# Altium schematic sheet Sheet2.SchDoc
size A3 portrait; Author: Gayani_Hewasura; Revision: *Keypad_Input_Subsystem
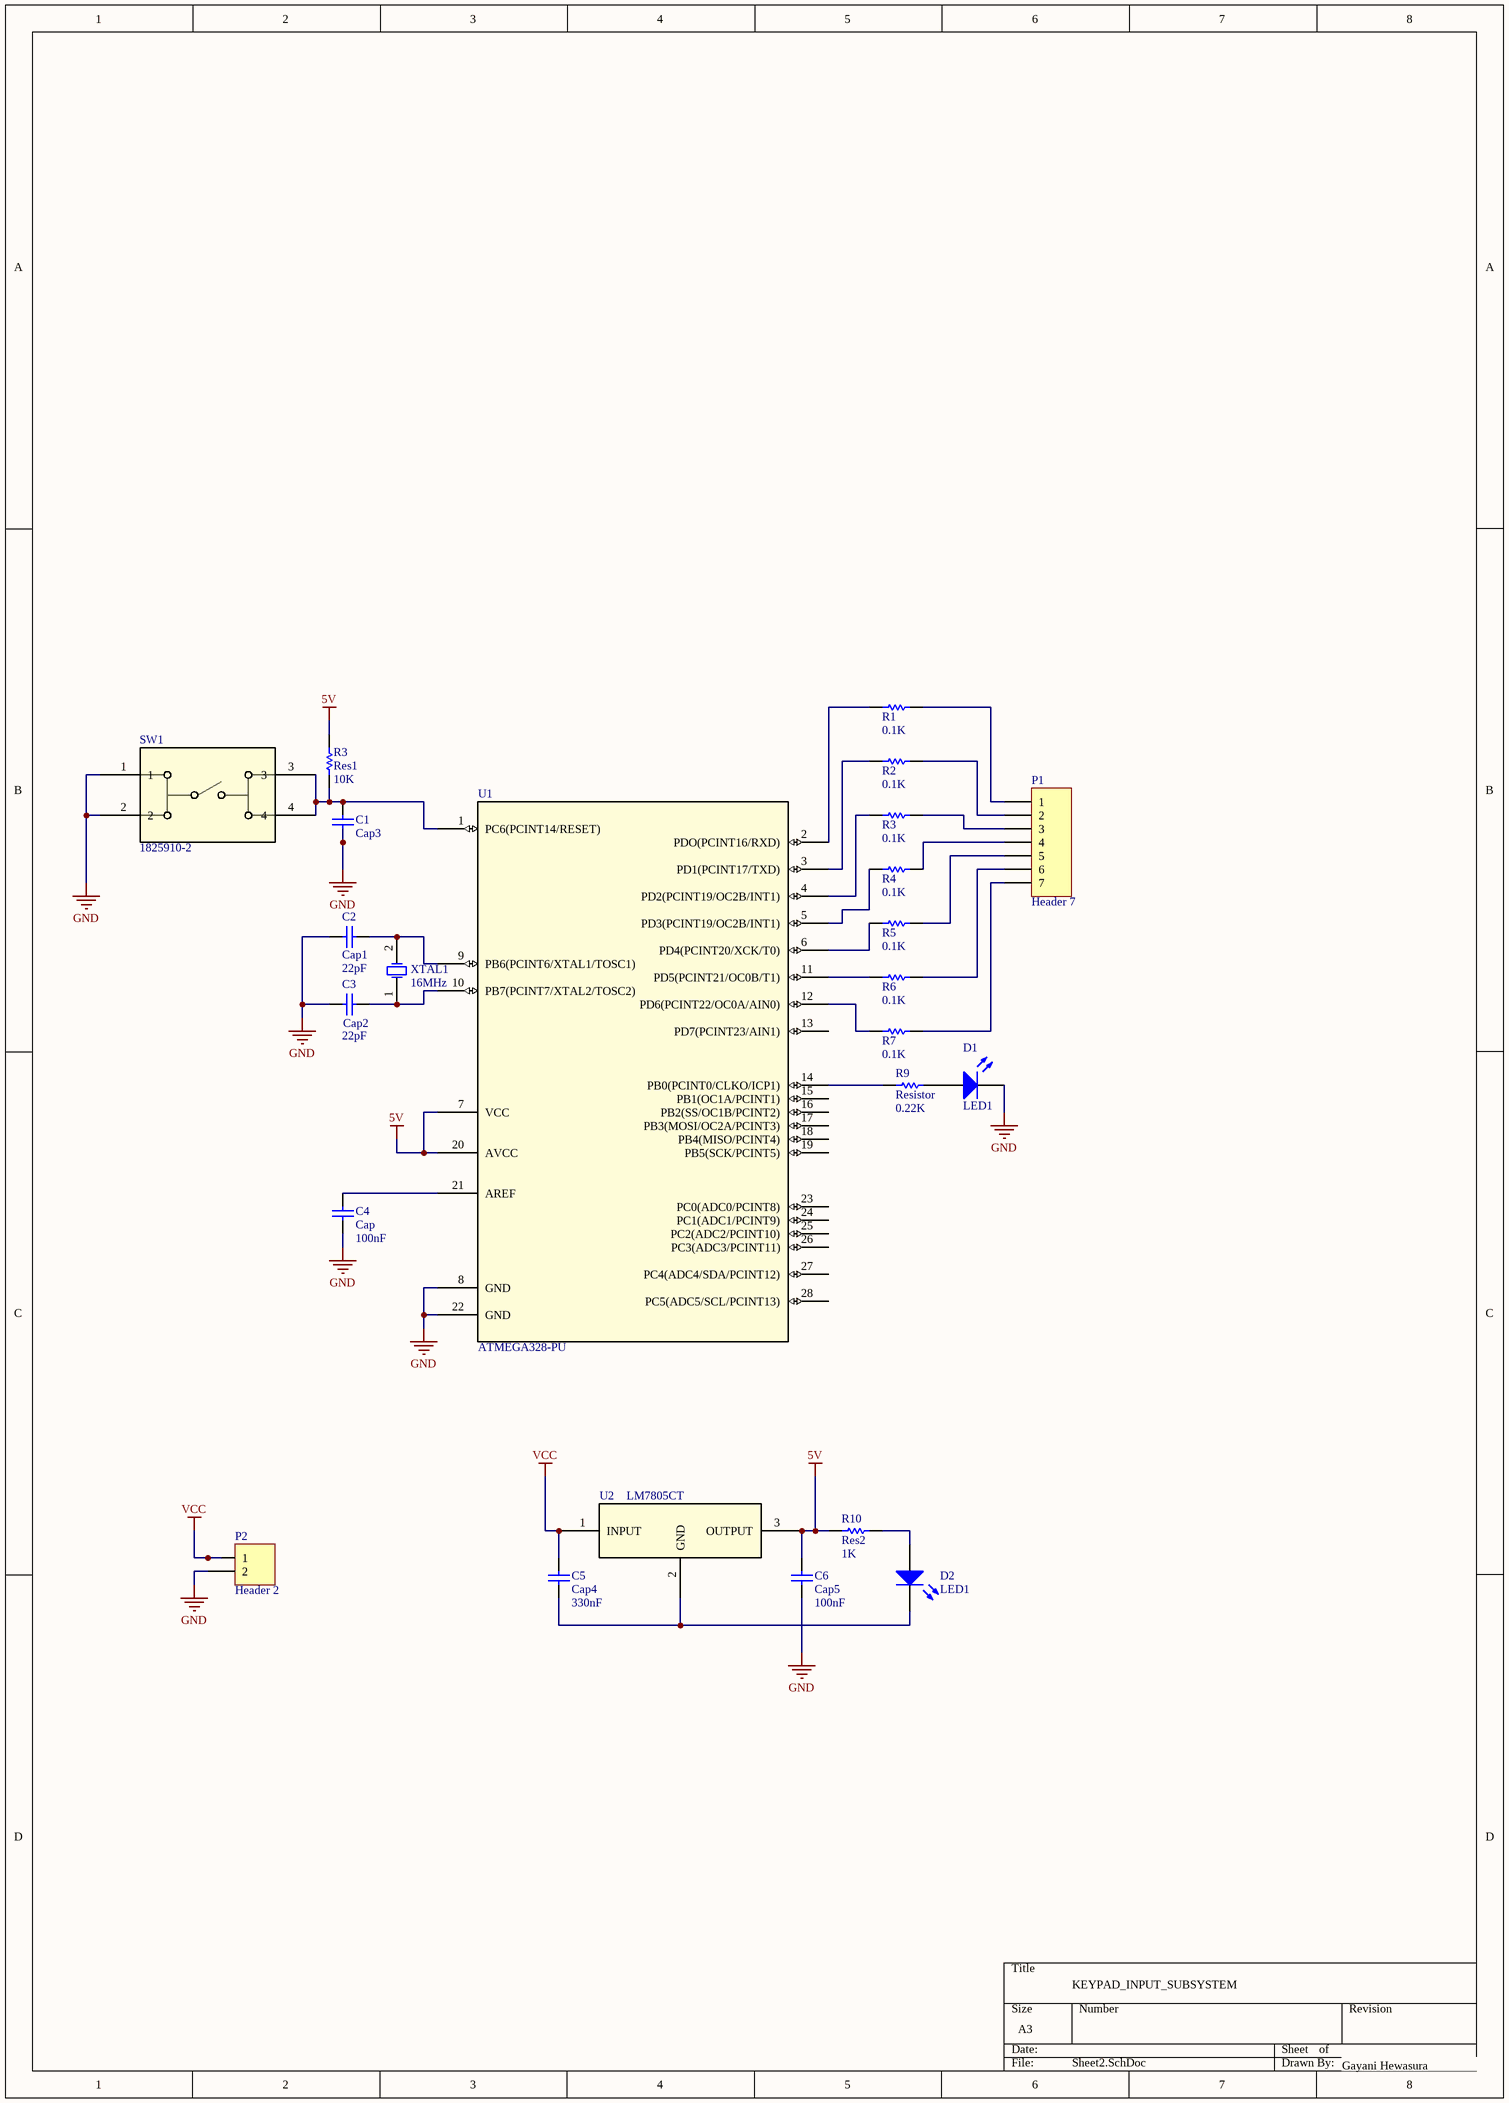
[diagram p0: Sheet2.SchDoc]

## Parts
C1  Cap3  [RAD-0.3]
C2  Cap1  value 22pF  [RAD-0.3]
C3  Cap2  value 22pF  [RAD-0.3]
C4  Cap  value 100nF  [RAD-0.3]
C5  Cap4  value 330nF  [RAD-0.3]
C6  Cap5  value 100nF  [RAD-0.3]
D1  LED1  [LED-1]
D2  LED1  [LED-1]
P1  Header 7  [HDR1X7]
P2  Header 2  [HDR1X2]
R1  R1  value 0.1K  [AXIAL-0.3]
R2  R2  value 0.1K  [AXIAL-0.3]
R3  Res1  value 10K  [AXIAL-0.3]
R4  R3  value 0.1K  [AXIAL-0.3]
R5  R4  value 0.1K  [AXIAL-0.3]
R6  R5  value 0.1K  [AXIAL-0.3]
R7  R6  value 0.1K  [AXIAL-0.3]
R8  R7  value 0.1K  [AXIAL-0.3]
R9  Resistor  value 0.22K  [AXIAL-0.3]
R10  Res2  value 1K  [AXIAL-0.3]
SW1  1825910-2  [SW4_1825910-A_TEC]
U1  ATMEGA328-PU  [28P3_SPDIP28_SP_MCH]
U2  LM7805CT  [TO-220_FAS]
Y1  XTAL1  value 16MHz  [R38]

## Nets
5V: C6.2 R3.2 R10.1 U1.7(VCC) U1.20(AVCC) U2.3(OUTPUT)
GND: C1.1 C2.1 C3.1 C4.1 C6.1 D1.2(K) P2.2 SW1.1 SW1.2 U1.8(GND) U1.22(GND)
VCC: C5.2 P2.1 U2.1(INPUT)
NetC1_2: C1.2 R3.1 SW1.3 SW1.4 U1.1(PC6(PCINT14/RESET))
NetC2_2: C2.2 U1.9(PB6(PCINT6/XTAL1/TOSC1)) Y1.2(OSC2)
NetC3_2: C3.2 U1.10(PB7(PCINT7/XTAL2/TOSC2)) Y1.1(OSC1)
NetC4_2: C4.2 U1.21(AREF)
NetC5_1: C5.1 D2.2(K) U2.2(GND)
NetD1_1: D1.1(A) R9.2
NetD2_1: D2.1(A) R10.2
NetP1_1: P1.1 R1.2
NetP1_2: P1.2 R2.2
NetP1_3: P1.3 R4.2
NetP1_4: P1.4 R5.2
NetP1_5: P1.5 R6.2
NetP1_6: P1.6 R7.2
NetP1_7: P1.7 R8.2
NetR1_1: R1.1 U1.2(PDO(PCINT16/RXD))
NetR2_1: R2.1 U1.3(PD1(PCINT17/TXD))
NetR4_1: R4.1 U1.4(PD2(PCINT19/OC2B/INT1))
NetR5_1: R5.1 U1.5(PD3(PCINT19/OC2B/INT1))
NetR6_1: R6.1 U1.6(PD4(PCINT20/XCK/T0))
NetR7_1: R7.1 U1.11(PD5(PCINT21/OC0B/T1))
NetR8_1: R8.1 U1.12(PD6(PCINT22/OC0A/AIN0))
NetR9_1: R9.1 U1.14(PB0(PCINT0/CLKO/ICP1))

Not connected (* = marked no-connect by the designer): U1 13(PD7(PCINT23/AIN1)) 15(PB1(OC1A/PCINT1)) 16(PB2(SS/OC1B/PCINT2)) 17(PB3(MOSI/OC2A/PCINT3)) 18(PB4(MISO/PCINT4)) 19(PB5(SCK/PCINT5)) 23(PC0(ADC0/PCINT8)) 24(PC1(ADC1/PCINT9)) 25(PC2(ADC2/PCINT10)) 26(PC3(ADC3/PCINT11)) 27(PC4(ADC4/SDA/PCINT12)) 28(PC5(ADC5/SCL/PCINT13))

## Notes on the sheet
- KEYPAD_INPUT_SUBSYSTEM
- Gayani Hewasura

## Library data of the parts
C1-C6 = Cap: Capacitor; Published: 8-Jun-2000; LatestRevisionDate: 17-Jul-2002; LatestRevisionNote: Re-released for DXP Platform.; PackageReference: RAD-0.3; Publisher: Altium Limited; PackageDescription: Radial Cap, Thru-Hole; 2 Leads; 0.3 in Pin Spacing
D1 D2 = LED1: Typical RED GaAs LED; Published: 8-Jun-2000; LatestRevisionDate: 08-Jul-2005; LatestRevisionNote: Mech Layer 1 removed.; PackageReference: LED-1; Publisher: Altium Limited; PackageDescription: LED; 2 Leads
P1 = Header 7: Header, 7-Pin; LatestRevisionDate: 17-Jul-2002; LatestRevisionNote: Re-released for DXP Platform.; Publisher: Altium Limited
P2 = Header 2: Header, 2-Pin; LatestRevisionDate: 17-Jul-2002; LatestRevisionNote: Re-released for DXP Platform.; Publisher: Altium Limited
R1-R8 R10 = Res1: Resistor; Published: 8-Jun-2000; LatestRevisionDate: 17-Jul-2002; LatestRevisionNote: Re-released for DXP Platform.; PackageReference: AXIAL-0.3; Publisher: Altium Limited; PackageDescription: Axial Device, Thru-Hole; 2 Leads; 0.3 in Pin Spacing
R9 = Res1: Published: 8-Jun-2000; LatestRevisionDate: 17-Jul-2002; LatestRevisionNote: Re-released for DXP Platform.; PackageReference: AXIAL-0.3; Publisher: Altium Limited; PackageDescription: Axial Device, Thru-Hole; 2 Leads; 0.3 in Pin Spacing
SW1 = 1825910-2: FSM2JH=6MM TACT SWITCH, HIGH TEMP; Vendor: TE Connectivity; Switch_Type: Tactile Switches; Configuration_(Pole-Throw): Single Pole - Single Throw; Built_By: EMA_UL_Team; SourceLibrary: TE_Connectivity-2018-03-16; Copyright: Copyright (C) 2016 Accelerated Designs. All rights reserved; Manufacturer_Part_Number: 1825910-2; Product_Type: Switch; TE_Part_Number: 1825910-2; Max_Switching_Current: -; Max_Switching_Voltage(AC): -; RefDes: RefDes; Type: DEV
U1 = ATMEGA328-PU: No Description Available; SourceLibrary: Update_to_database_2021-05-13; Built_By: EMA_Cory; Vendor: Microchip; Datasheet: https://ww1.microchip.com/downloads/en/DeviceDoc/ATmega48A-PA-88A-PA-168A-PA-328-P-DS-DS40002061B.pdf; Copyright: Copyright (C) 2018 Accelerated Designs. All rights reserved; Manufacturer_Part_Number: ATMEGA328-PU; RefDes: RefDes; Type: DEV
U2 = LM7805CT: No Description Available; Vendor: Fairchild Semiconductor; Built_By: EMA_UL_Team; SourceLibrary: Fairchild_2008-01-01_; Manufacturer_Part_Number: LM7805CT; Copyright: Copyright (C) 2018 Accelerated Designs. All rights reserved; RefDes: RefDes; Type: DEV
Y1 = XTAL: Crystal Oscillator; Published: 8-Jun-2000; LatestRevisionDate: 17-Jul-2002; LatestRevisionNote: Re-released for DXP Platform.; PackageReference: R38; Publisher: Altium Limited; PackageDescription: Crystal, Thru-Hole; 2 Leads; Body 3.1 x 8.2 mm (Dia.xH)